# EAGLE design DIDV_-_Alto_Falantes (EAGLE 6.2)
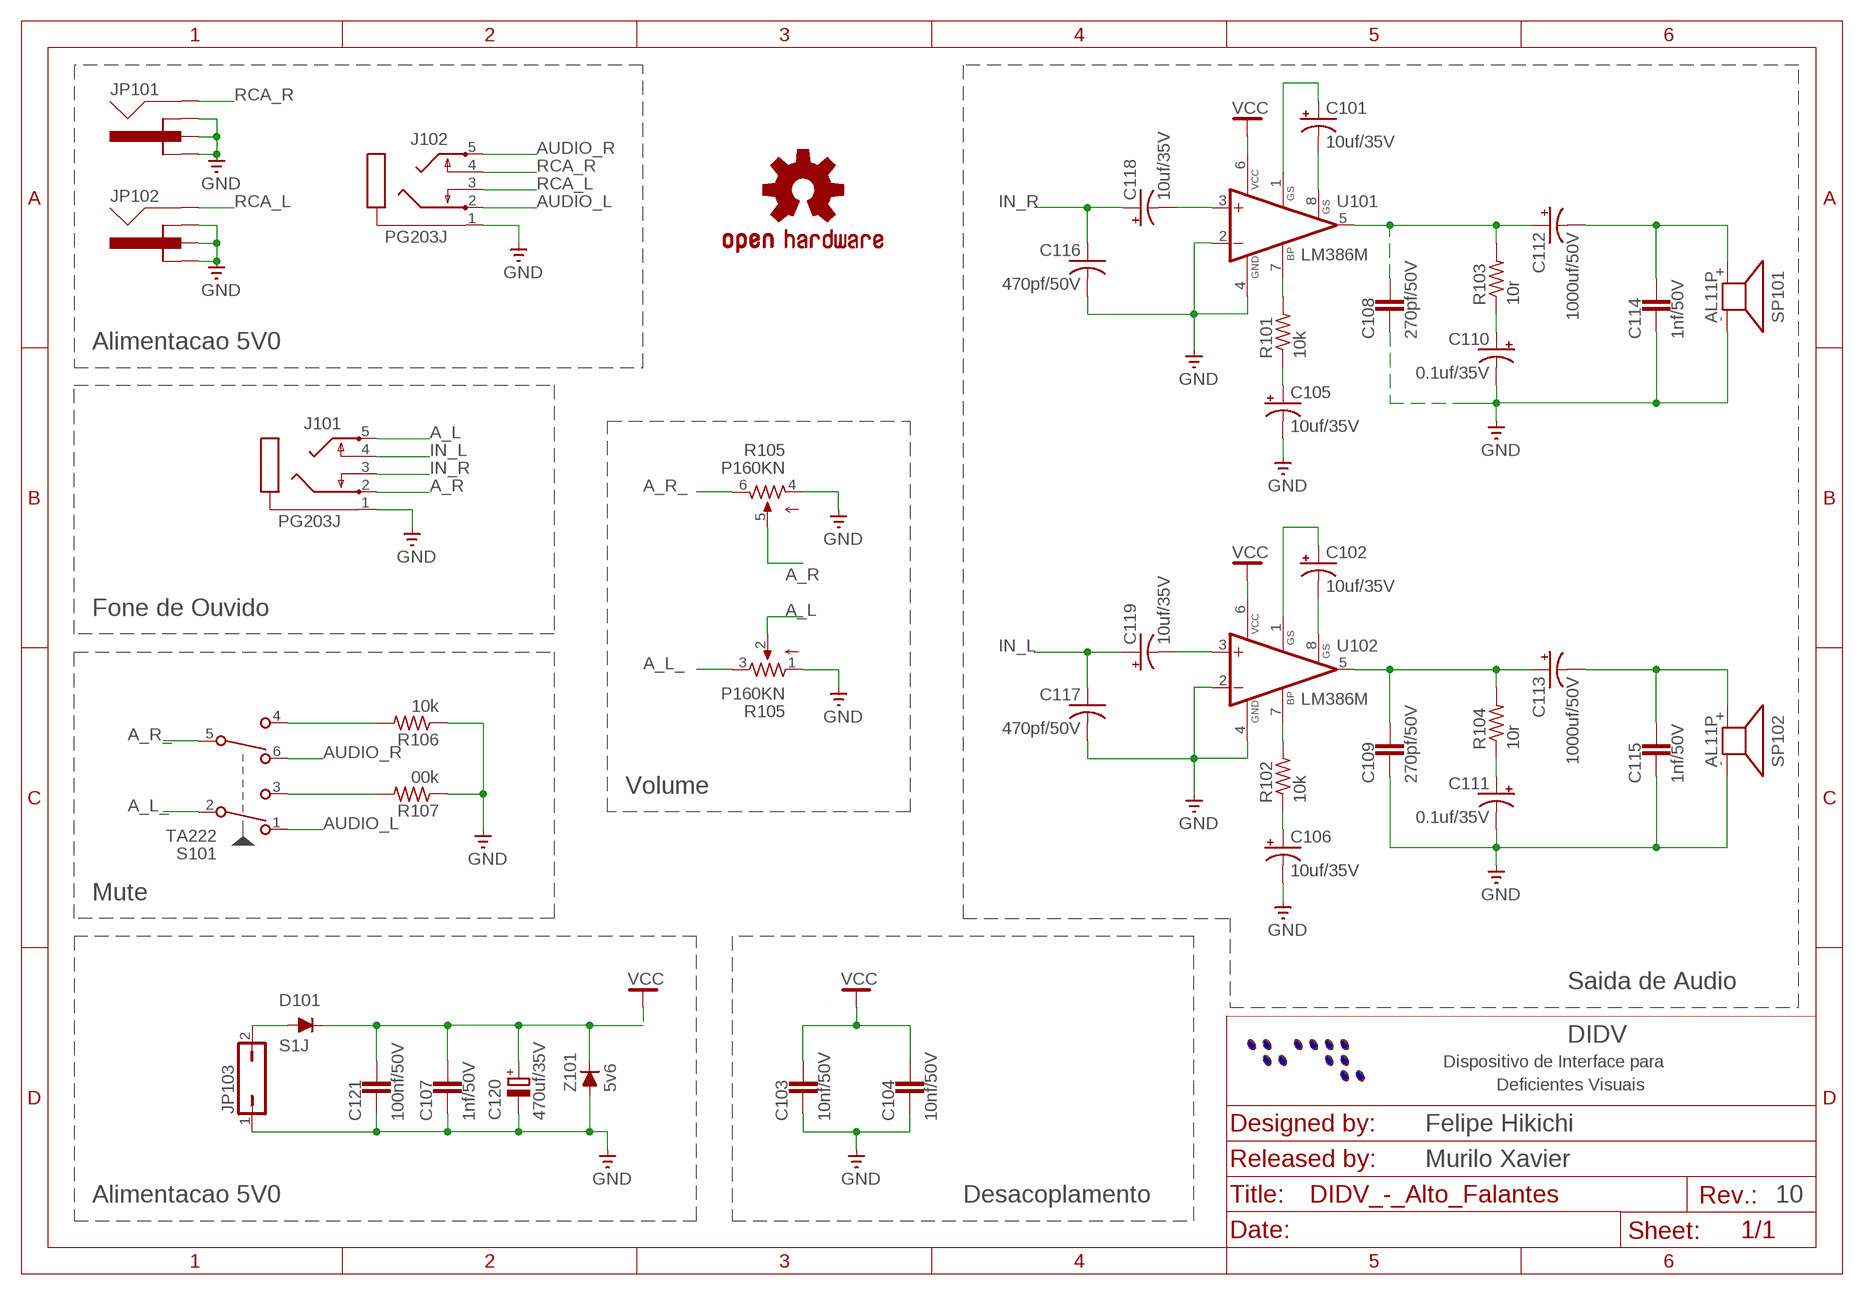
[diagram p0: schematic, sheet 1]

## Parts
C101  10uf/35V  CPOL-USE2-5  [E2-5]
C102  10uf/35V  CPOL-USE2-5  [E2-5]
C103  10nf/50V  C-EUC0805  [C0805]
C104  10nf/50V  C-EUC0805  [C0805]
C105  10uf/35V  CPOL-USE2-5  [E2-5]
C106  10uf/35V  CPOL-USE2-5  [E2-5]
C107  1nf/50V  C-EUC0805  [C0805]
C108  270pf/50V  C-EUC0805  [C0805]
C109  270pf/50V  C-EUC0805  [C0805]
C110  0.1uf/35V  CPOL-USE2-5  [E2-5]
C111  0.1uf/35V  CPOL-USE2-5  [E2-5]
C112  1000uf/50V  CPOL-USE3.5-10  [E3,5-10]
C113  1000uf/50V  CPOL-USE3.5-10  [E3,5-10]
C114  1nf/50V  C-EUC0805  [C0805]
C115  1nf/50V  C-EUC0805  [C0805]
C116  470pf/50V  C-USC0603  [C0603]
C117  470pf/50V  C-USC0603  [C0603]
C118  10uf/35V  CPOL-USE2-5  [E2-5]
C119  10uf/35V  CPOL-USE2-5  [E2-5]
C120  470uf/35V  CPOL-EUE3.5-10  [E3,5-10]
C121  100nf/50V  C-EUC0805  [C0805]
D101  S1J  FS1J  [DO214AC]
J101  PG203J  [PG203J]
J102  PG203J  [PG203J]
JP101  RCA  [RCA]
JP102  RCA  [RCA]
JP103  JP1Q  [JP1]
LOGO101  OSHW-LOGOL  [OSHW-LOGO-L]
R101  10k  R-US_R1206  [R1206]
R102  10k  R-US_R1206  [R1206]
R103  10r  R-US_R1206  [R1206]
R104  10r  R-US_R1206  [R1206]
R105  P160KN  [P160KN]
R106  10k  R-US_R1206  [R1206]
R107  00k  R-US_R1206  [R1206]
S101  TA222  [TA222]
SP101  AL11P  [AL11P]
SP102  AL11P  [AL11P]
U101  LM386M  [SO08]
U102  LM386M  [SO08]
Z101  5v6  BAS70  [SOT23]

## Nets
A_L: J101.5 R105.2
A_L_: R105.3 S101.2(A-COM)
A_R: J101.2 R105.5
A_R_: R105.6 S101.5(B-COM)
AUDIO_L: J102.2 S101.1(A-NC)
AUDIO_R: J102.5 S101.6(B-NC)
GND: C103.2 C104.2 C105.- C106.- C107.2 C108.2 C109.2 C110.- C111.- C114.2 C115.2 C116.2 C117.2 C120.- C121.2 J101.1 J102.1 JP101._1GND(GND1) JP101._2GND(GND2) JP101._GND(GND) JP102._1GND(GND1) JP102._2GND(GND2) JP102._GND(GND) JP103.1 R105.1 R105.4 R106.1 R107.1 SP101.- SP102.- U101.2(-IN) U101.4(GND) U102.2(-IN) U102.4(GND) Z101.1(A)
IN_L: C117.1 C119.+ J101.4
IN_R: C116.1 C118.+ J101.3
N$1: C105.+ R101.1
N$2: R101.2 U101.7(BS2)
N$3: C110.+ R103.1
N$4: C108.1 C112.+ R103.2 U101.5(OUT)
N$5: C101.- U101.8(GAIN)
N$6: C101.+ U101.1(GAIN)
N$7: C118.- U101.3(+IN)
N$8: C113.- C115.1 SP102.+
N$9: C112.- C114.1 SP101.+
N$10: R106.2 S101.4(B-NO)
N$11: C106.+ R102.1
N$12: R102.2 U102.7(BS2)
N$13: C111.+ R104.1
N$14: C109.1 C113.+ R104.2 U102.5(OUT)
N$15: C102.- U102.8(GAIN)
N$16: C102.+ U102.1(GAIN)
N$17: C119.- U102.3(+IN)
N$18: R107.2 S101.3(A-NO)
N$43: D101.A JP103.2
RCA_L: J102.3 JP102._SIGNAL(SIGNAL)
RCA_R: J102.4 JP101._SIGNAL(SIGNAL)
VCC: C103.1 C104.1 C107.1 C120.+ C121.1 D101.C U101.6(VS) U102.6(VS) Z101.3(C)

## Notes on the sheet
- Alimentacao 5V0
- Fone de Ouvido
- Volume
- Mute
- Saida de Audio
- DIDV
- Dispositivo de Interface para
- Deficientes Visuais
- Felipe Hikichi
- Murilo Xavier
- Alimentacao 5V0 | Desacoplamento | 10

## Library data of the parts
C101 C102 C105 C106 C110-C113 C118 C119 = resistor:CPOL-US: POLARIZED CAPACITOR, American symbol
C103 C104 C107-C109 C114 C115 C121 = rcl:C-EU: CAPACITOR, European symbol
C116 C117 = rcl:C-US: CAPACITOR, American symbol
C120 = rcl:CPOL-EU: POLARIZED CAPACITOR, European symbol
D101 = diode:FS1J: Rectifier Diode
J101 J102 = con-hirschmann:PG203J: MIC/HEADPHONE JACK KS-S stereo microphone/headphone jack PG203JN (Schukat)
JP101 JP102 = RCA_Hikichi:RCA
JP103 = jumper:JP1Q: JUMPER
LOGO101 = OpenHW_BOT:OSHW-LOGO: Open Source Hardware Logo This logo indicates the piece of hardware it is found on incorporates a OSHW license and/or adheres to the definition of open source hardware found here: http://freedomdefined.org/OSHW
R101-R104 R106 R107 = rcl:R-US_: RESISTOR, American symbol
R105 = pot_hikichi:P160KN: POTENTIOMETER - 11 mm 6 mm shaft, 18 teeth knurl
S101 = switch-e-switch:TA222: PUSHBUTTON SWITCH
SP101 SP102 = buzzer:AL11P: SPEAKER Source: Buerklin
U101 U102 = linear:LM386: Low Voltage Audio Power Amplifier
Z101 = diode:BAS70: Silicon Schottky Diodes General-purpose diode for high-speed switching

## Board
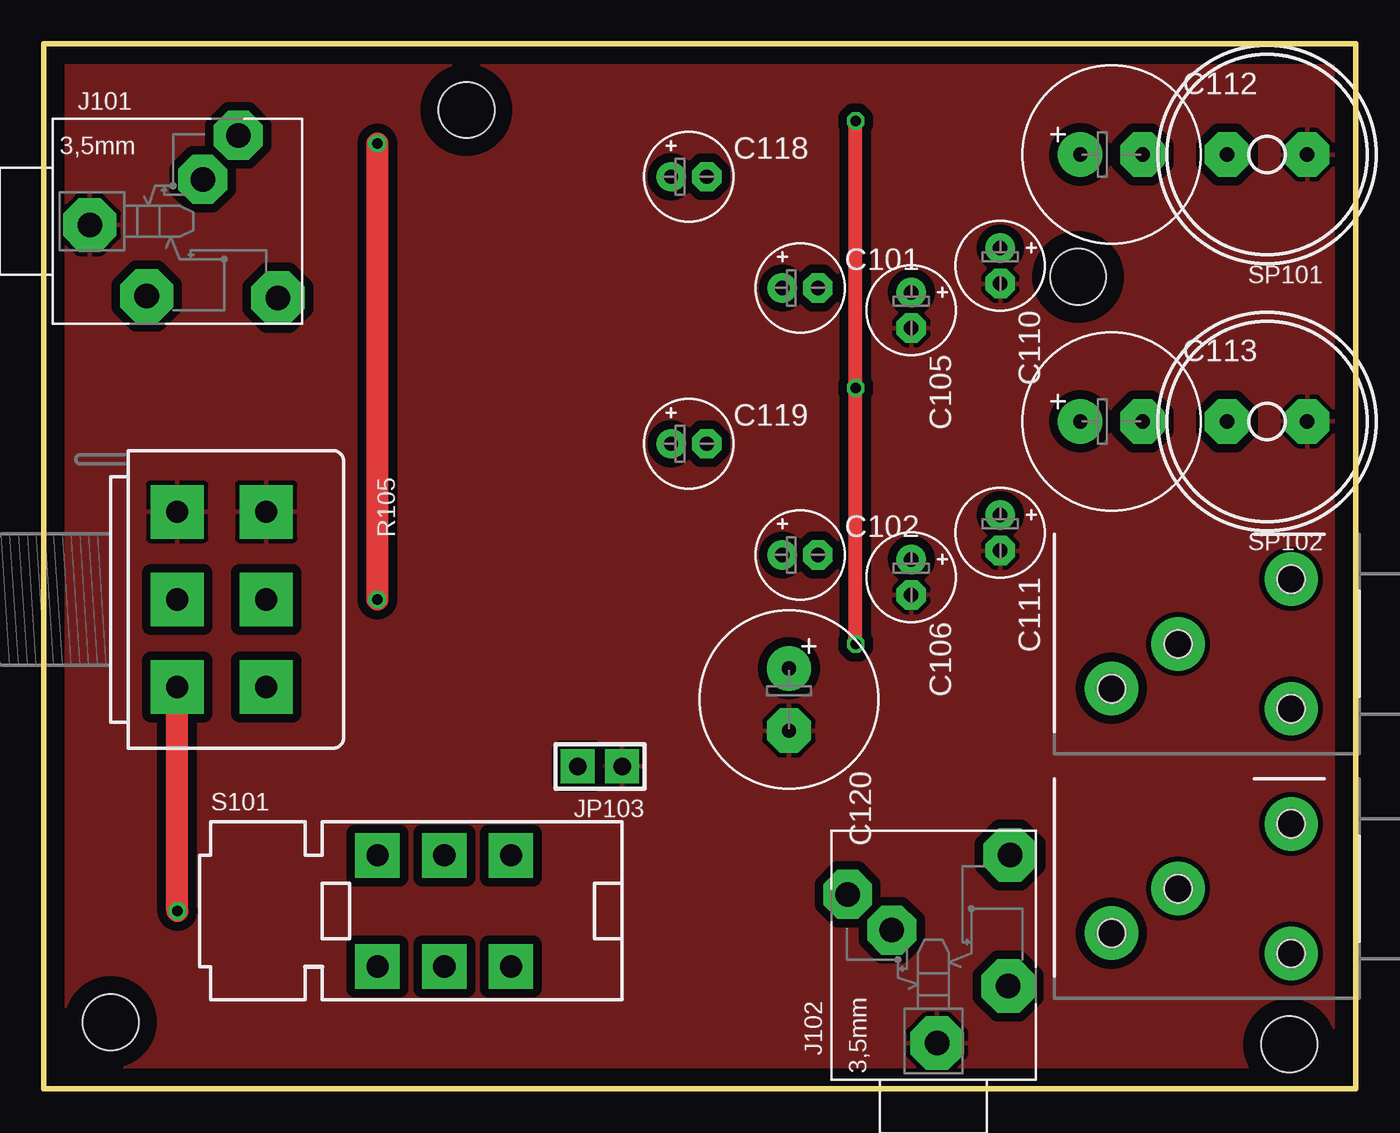
[diagram p1: board, top side]
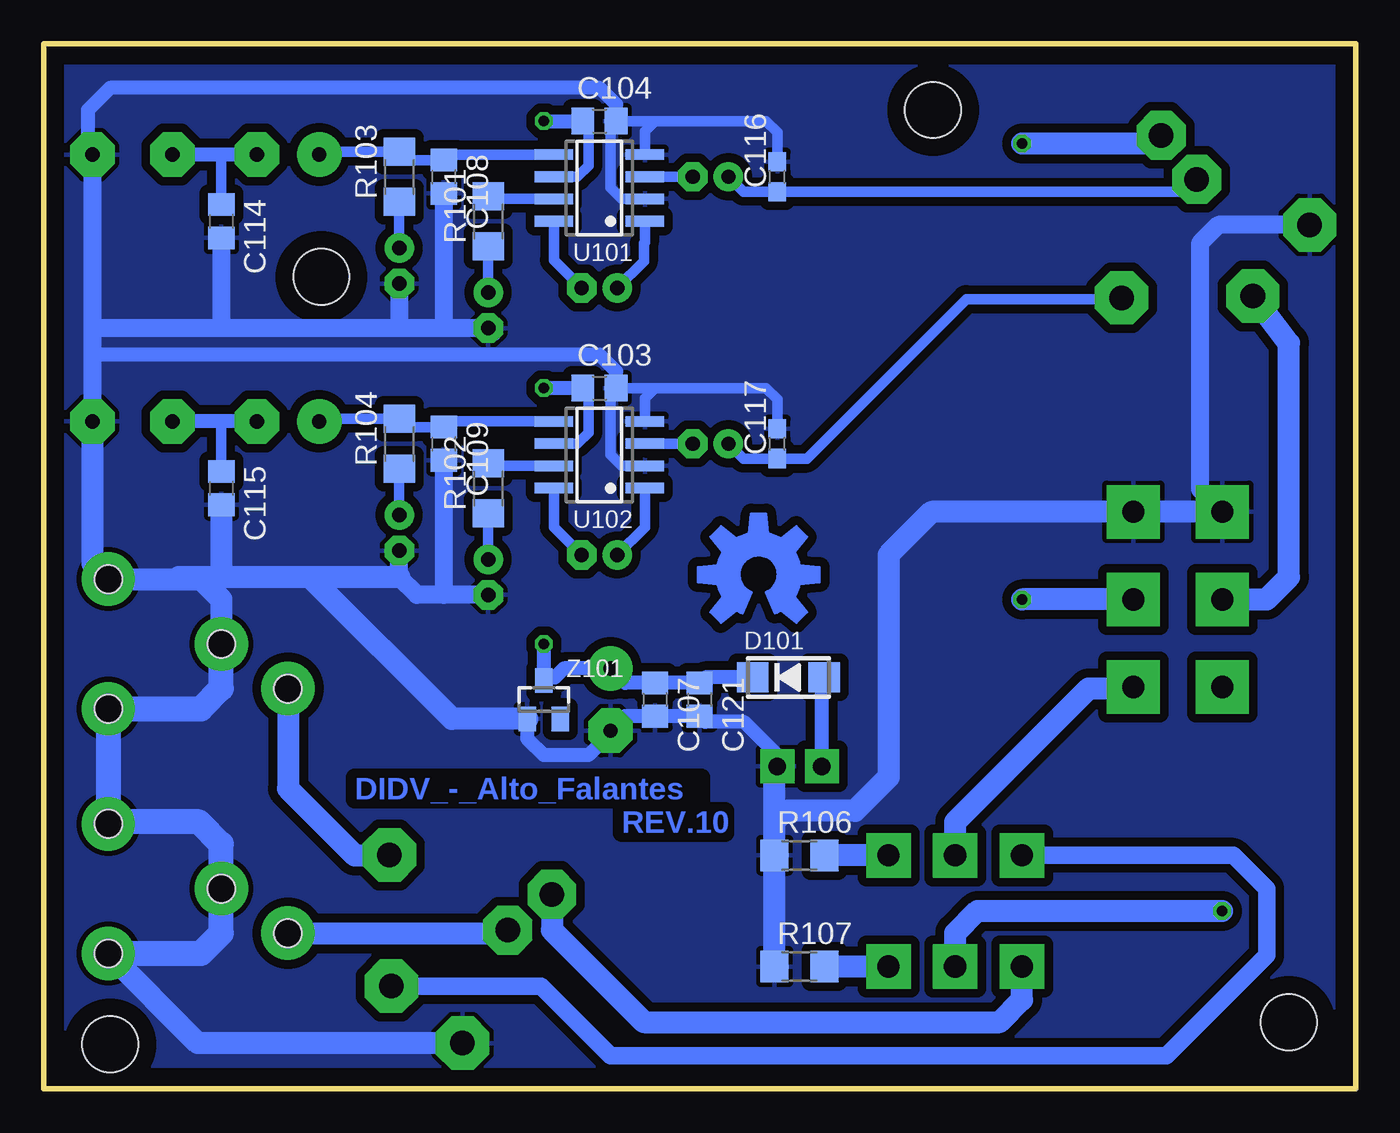
[diagram p2: board, bottom side, seen from below]

Size 74.92 x 59.66 mm. Coordinates in mm from the lower left corner, seen from the top.
Outline: 0.01,0 74.92,0 74.91,59.66 0,59.66 0.01,0
Copper layers (1*16): Top 0.035mm / dielectric 1.5mm / Bottom 0.035mm
Design rules: minimum track width 10mil, minimum drill 24mil, track to track 8mil, track to pad 8mil, pad to pad 8mil, via to via 8mil, smd to smd 8mil, copper to edge 40mil, drill to drill 8mil, minimum pad ring 10mil, minimum via ring 8mil, stop-mask expansion 4mil, vias tented up to drill 0mil, thermal gap 10mil
Holes 3.2 mm at 3.82,3.81 24.14,55.88 71.13,2.54 59.06,46.35

### Footprints (pad centres in the part's own frame; a part is rotated, then mirrored left to right if it is on the bottom)
E2-5 = drill 0.813 pad 1.676: + -1.016,0 | drill 0.813 pad 1.676 octagon: - 1.016,0
C0805 = smd 1.3 x 1.5: 1 -0.95,0; 2 0.95,0
E3,5-10 = drill 0.813 pad 2.54: + -1.778,0 | drill 0.813 pad 2.54 octagon: - 1.778,0
C0603 = smd 1.1 x 1: 1 -0.85,0; 2 0.85,0
DO214AC = smd 1.8 x 1.7: A 2.05,0; C -2.05,0
PG203J = drill 1.4 pad 3.048 octagon: 1 -5.004,-0.203; 4 5.74,-4.369; 5 -1.753,-4.267 | drill 1.4 pad 2.794 octagon: 2 3.48,4.902; 3 1.448,2.388
RCA = drill 1.6 pad 3.048: _1GND -0.11,-3.7; _2GND 6.35,0; _GND -0.11,3.7; _SIGNAL 10.16,2.54 | hole 1.6: -0.1,3.7; 10.15,2.55; 6.35,0; -0.1,-3.7
JP1 = drill 1 pad 1.93 square: 1 0,-1.27; 2 0,1.27
R1206 = smd 1.6 x 1.803: 1 -1.422,0; 2 1.422,0
P160KN = drill 1.27 pad 3.048 square: 1 -3.8,-5; 2 -3.8,0; 3 -3.8,5; 4 -8.88,-5; 5 -8.88,0; 6 -8.88,5
TA222 = drill 1.27 pad 2.54 square: 1 -3.81,-3.175; 2 0,-3.175; 3 3.81,-3.175; 4 3.81,3.175; 5 0,3.175; 6 -3.81,3.175
AL11P = drill 0.813 pad 2.54 octagon: + 2.286,0; - -2.286,0
SO08 = smd 0.6 x 2.2: 1 -1.905,-2.6; 2 -0.635,-2.6; 3 0.635,-2.6; 4 1.905,-2.6; 5 1.905,2.6; 6 0.635,2.6; 7 -0.635,2.6; 8 -1.905,2.6
SOT23 = smd 1 x 1.4: 1 -0.95,-1.1; 2 0.95,-1.1; 3 0,1.1

### Placement (x,y rotation side)
C101  43.19,45.72 0 top
C102  43.19,30.48 0 top
C103  43.19,40.01 0 bottom
C104  43.19,55.24 0 bottom
C105  49.54,44.45 270 top
C106  49.54,29.21 270 top
C107  40.02,22.23 270 bottom
C108  52.08,52.07 270 bottom
C109  52.08,36.83 270 bottom
C110  54.62,46.99 270 top
C111  54.62,31.75 270 top
C112  60.97,53.34 0 top
C113  60.97,38.1 0 top
C114  64.78,49.53 270 bottom
C115  64.78,34.29 270 bottom
C116  33.03,52.07 90 bottom
C117  33.03,36.83 90 bottom
C118  36.84,52.07 0 top
C119  36.84,36.83 0 top
C120  42.55,22.23 270 top
C121  37.48,22.23 270 bottom
D101  32.39,23.5 0 bottom
J101  7.63,49.53 0 top
J102  50.81,7.62 90 top
JP101  71.13,25.4 180 top
JP102  71.13,11.43 180 top
JP103  31.76,18.41 90 top
LOGO101  34.1,29.36 0 top
R101  49.54,49.53 90 bottom
R102  49.54,34.29 90 bottom
R103  54.62,52.07 90 bottom
R104  54.62,36.83 90 bottom
R105  3.82,27.94 180 top
R106  31.76,13.34 0 bottom
R107  31.76,6.99 0 bottom
S101  22.87,10.16 0 top
SP101  69.86,53.34 180 top
SP102  69.86,38.1 180 top
U101  43.19,51.44 90 bottom
U102  43.19,36.2 90 bottom
Z101  46.36,22.23 0 bottom

### Tracks (layer width: path | path; a pad name or v marks a point on that pad's centre or on a via)
A_L
  Bottom 1.27: R105.2 5.09,27.94 3.82,29.21 3.82,42.57 J101.5
A_L_  (via drill 0.6)
  Top 1.27: v7.63,10.16 R105.3
  Bottom 1.27: S101.2 22.87,8.89 21.6,10.16 v7.63,10.16
A_R  (via drill 0.6)
  Top 1.27: v19.06,27.94 v19.06,53.98
  Bottom 1.27: 10.65,54.61 J101.2 11.57,53.98 v19.06,53.98 | R105.5 v19.06,27.94
A_R_
  Bottom 1.27: S101.5 22.87,15.24 15.25,22.86 12.78,22.86 R105.6
AUDIO_L
  Bottom 1.27: J102.2 45.91,9.07 40.65,3.81 20.33,3.81 19.06,5.08 S101.1
AUDIO_R
  Bottom 1: J102.5 46.52,5.87 42.55,1.91 10.8,1.91 5.09,7.62 5.09,11.43 7,13.34 S101.6
GND
  Bottom 0.61: R106.1 33.18,12.7 33.03,12.85 | U102.2 41.92,35.56 42.55,36.2 42.55,39.69 C103.2 40.02,40.01 | U102.4 40.59,39.43 40.02,40.01 | 40.02,40.01 33.66,40.01 33.03,39.37 C117.2 | 40.02,55.24 33.66,55.24 33.03,54.61 C116.2 | U101.4 40.59,54.67 40.02,55.24 | 40.02,55.24 C104.2 42.55,54.93 42.55,51.44 41.92,50.8 U101.2
  Bottom 0.813: JP103.1 33.03,19.05 34.93,20.95 37.16,20.95 C121.2 C107.2 41.73,21.27 C120.- 42.55,20.32 43.82,19.05 46.36,19.05 47.31,20 Z101.1 | C103.2 42.24,40.96 43.19,41.91 72.15,41.91 | C104.2 42.24,56.2 43.19,57.15 71.13,57.15 72.4,55.88 72.4,53.59 SP101.-
  Bottom 1.016: 49.29,43.18 C105.- 52.08,43.43 | 52.08,43.43 54.62,43.43 | 54.62,43.43 64.78,43.43 | 64.78,43.43 71.89,43.43 72.15,43.18 | 72.4,38.35 SP102.- 72.15,41.91 72.15,43.18 | C110.- 54.62,43.43 | C108.2 52.08,43.43 | C114.2 64.78,43.43 | SP101.- 72.15,43.18 | J101.1 7.83,49.33 8.9,48.26 8.9,34.22 R105.1 | C106.- 52.08,28.19 | 52.08,28.19 53.6,28.19 54.62,29.21 C111.- | C109.2 52.08,28.19
  Bottom 1.27: 71.13,7.62 JP102._GND 66.13,2.62 J102.1 | R107.1 R106.1 33.18,15.24 | 33.18,15.24 33.18,18.26 JP103.1 | R105.1 R105.4 24.22,32.94 26.68,30.48 26.68,17.78 28.59,15.88 32.55,15.88 33.18,15.24 | 67.32,29.1 JP101._1GND 72.15,30.01 SP102.- | 67.32,29.1 65.94,29.1 64.78,27.94 JP101._2GND | Z101.1 51.61,21.12 59.7,29.21 | 59.7,29.21 64.78,29.21 | 64.78,29.21 67.21,29.21 67.32,29.1 | 54.62,29.21 59.7,29.21 | C115.2 64.78,29.21
  Bottom 1.422: JP101._2GND 64.78,22.86 65.94,21.7 JP101._GND JP102._1GND 71.13,15.24 66.05,15.24 64.78,13.97 JP102._2GND 64.78,8.89 65.94,7.73 JP102._GND
  pour Bottom (isolate 0.5): 0.01,0 74.94,0 74.94,59.69 0.01,59.69
  pour Top (isolate 0.5): 0.01,0 74.94,0 74.94,59.69 0.01,59.69
IN_L
  Bottom 0.61: C119.+ 34.97,35.98 C117.1 31.34,35.98 22.24,45.09 13.45,45.09 J101.4
IN_R
  Bottom 0.61: C118.+ 34.97,51.22 C116.1 9.78,51.22 J101.3
N$1
  Bottom 0.61: R101.1 C105.+
N$2
  Bottom 0.61: U101.7 49.54,50.8 R101.2
N$3
  Bottom 0.61: R103.1 C110.+
N$4
  Bottom 0.61: U101.5 52.08,53.34 C108.1 54.62,53.02 R103.2 59.04,53.49 C112.+
N$5
  Bottom 0.61: U101.8 45.79,47.3 C101.-
N$6
  Bottom 0.61: U101.1 40.59,48.32 40.65,48.26 40.65,47.24 C101.+
N$7
  Bottom 0.61: U101.3 C118.-
N$8
  Bottom 0.61: C115.1 64.78,38.1
  Bottom 0.813: C113.- 64.78,38.1 SP102.+
N$9
  Bottom 0.61: C114.1 64.78,53.34
  Bottom 0.813: C112.- 64.78,53.34 SP101.+
N$10
  Bottom 1.27: S101.4 R106.2
N$11
  Bottom 0.61: R102.1 C106.+
N$12
  Bottom 0.61: U102.7 49.39,35.56 R102.2
N$13
  Bottom 0.61: R104.1 C111.+
N$14
  Bottom 0.61: U102.5 51.76,38.1 C109.1 54.15,37.78 R104.2 59.04,38.25 C113.+
N$15
  Bottom 0.61: U102.8 45.79,32.06 C102.-
N$16
  Bottom 0.61: U102.1 40.59,32.06 C102.+
N$17
  Bottom 0.61: U102.3 C119.-
N$18
  Bottom 1.27: S101.3 R107.2
N$43
  Bottom 0.813: JP103.2 30.49,23.35 D101.A
RCA_L
  Bottom 1.27: JP102._SIGNAL 48.6,8.89 J102.3
RCA_R
  Bottom 1.27: JP101._SIGNAL 60.97,17.14 57.16,13.34 55.2,13.34 J102.4
VCC  (via drill 0.6)
  Top 0.813: v46.36,55.24 v46.36,40.01 v46.36,25.4
  Bottom 0.61: U102.6 44.46,36.83 43.82,37.47 43.82,39.69 C103.1 | U101.6 44.46,52.07 43.82,52.7 43.82,54.93 C104.1
  Bottom 0.813: D101.C 37.16,23.5 C121.1 C107.1 41.73,23.18 C120.+ 45.22,24 45.73,23.5 46.2,23.5 Z101.3 v46.36,25.4 | C103.1 v46.36,40.01 | v46.36,55.24 C104.1

### Text on the board
Bottom: DIDV_-_Alto_Falantes | REV.10